# Altium schematic sheet main.SchDoc
size A3; Hw_rev: R1; Address3: Firenze; Address4: ITALY; Revision: 0; SheetNumber: 2; SheetTotal: 3
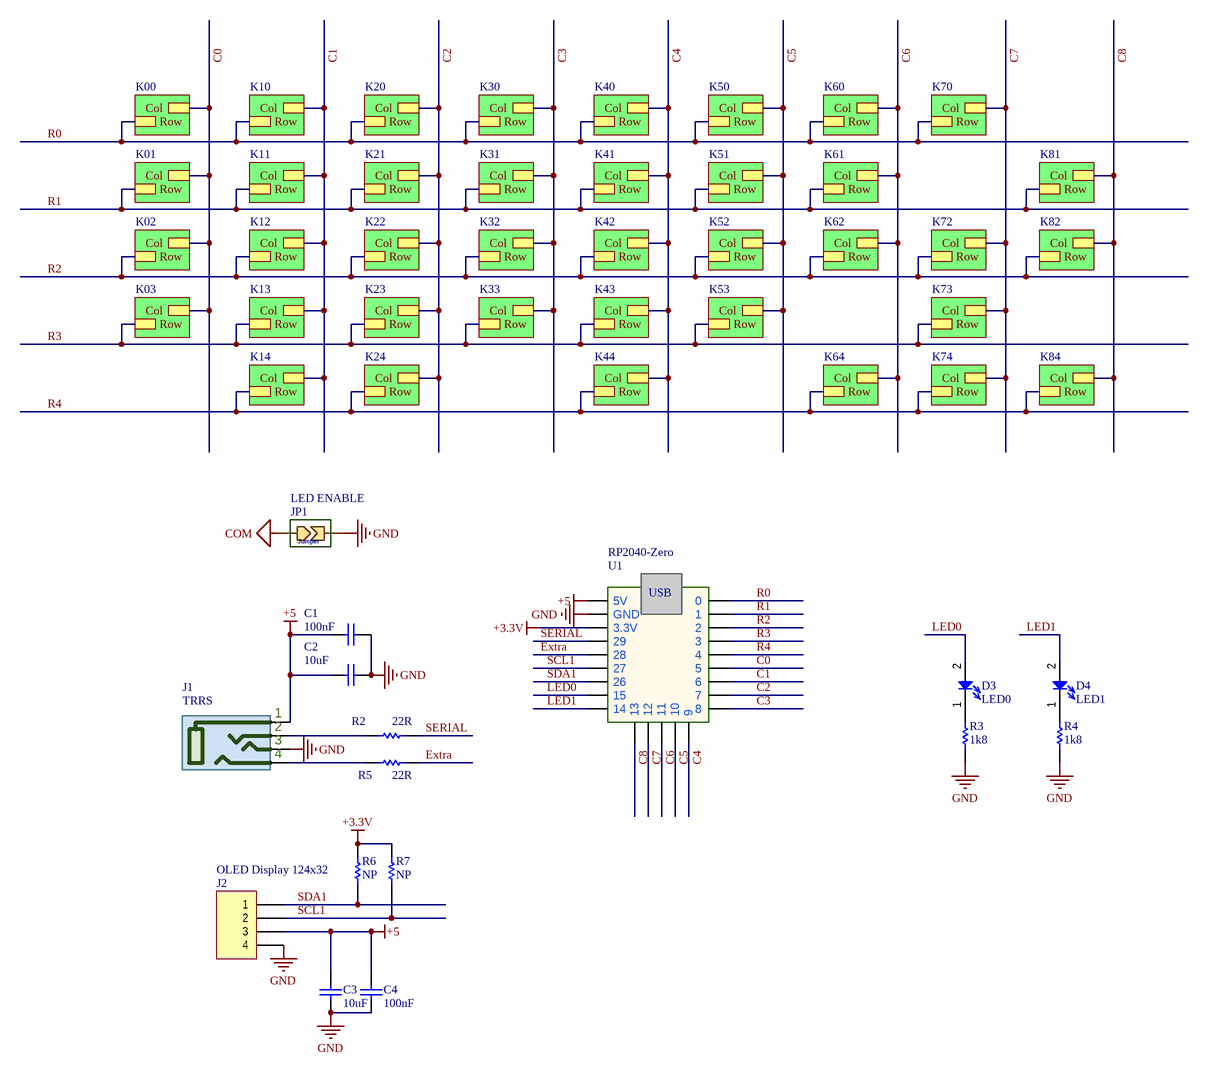
[diagram p0: main.SchDoc]

## Parts
C1  100nF  [0402_[1005]]
C2  10uF  [0603_[1608]]
C3  10uF  [0603_[1608]]
C4  100nF  [0402_[1005]]
D3  LED0  [0402_[1005]_K1-A2_LED]
D4  LED1  [0402_[1005]_K1-A2_LED]
J1  TRRS  [CON_PHONE_TRRS_3.5MM_THD]
J2  OLED Display 124x32  [HEADER_1X4_2.54MM_THD]
JP1  LED ENABLE  [0603_[1608]_JUMPER]
R2  22R  [0402_[1005]]
R3  1k8  [0402_[1005]]
R4  1k8  [0402_[1005]]
R5  22R  [0402_[1005]]
R6  NP  [0402_[1005]]
R7  NP  [0402_[1005]]
U1  RP2040-Zero  [RP2040-Zero]

## Sub-sheets
K00 = key-cell.SchDoc: Col, Row
K01 = key-cell.SchDoc: Col, Row
K02 = key-cell.SchDoc: Col, Row
K03 = key-cell.SchDoc: Col, Row
K10 = key-cell.SchDoc: Col, Row
K11 = key-cell.SchDoc: Col, Row
K12 = key-cell.SchDoc: Col, Row
K13 = key-cell.SchDoc: Col, Row
K14 = key-cell.SchDoc: Col, Row
K20 = key-cell.SchDoc: Col, Row
K21 = key-cell.SchDoc: Col, Row
K22 = key-cell.SchDoc: Col, Row
K23 = key-cell.SchDoc: Col, Row
K24 = key-cell.SchDoc: Col, Row
K30 = key-cell.SchDoc: Col, Row
K31 = key-cell.SchDoc: Col, Row
K32 = key-cell.SchDoc: Col, Row
K33 = key-cell.SchDoc: Col, Row
K40 = key-cell.SchDoc: Col, Row
K41 = key-cell.SchDoc: Col, Row
K42 = key-cell.SchDoc: Col, Row
K43 = key-cell.SchDoc: Col, Row
K44 = key-cell.SchDoc: Col, Row
K50 = key-cell.SchDoc: Col, Row
K51 = key-cell.SchDoc: Col, Row
K52 = key-cell.SchDoc: Col, Row
K53 = key-cell.SchDoc: Col, Row
K60 = key-cell.SchDoc: Col, Row
K61 = key-cell.SchDoc: Col, Row
K62 = key-cell.SchDoc: Col, Row
K64 = key-cell.SchDoc: Col, Row
K70 = key-cell.SchDoc: Col, Row
K72 = key-cell.SchDoc: Col, Row
K73 = key-cell.SchDoc: Col, Row
K74 = key-cell.SchDoc: Col, Row
K81 = key-cell.SchDoc: Col, Row
K82 = key-cell.SchDoc: Col, Row
K84 = key-cell.SchDoc: Col, Row

## Nets
+3.3V: R6.2 R7.2 U1.20(3.3V)
+5: C1.2 C2.2 C3.2 C4.2 J1.1 J2.3 U1.22(5V)
COM: JP1.1
GND: C1.1 C2.1 C3.1 C4.1 J1.3 J2.4 JP1.2 R3.1 R4.1 U1.21(GND)
C0: U1.5 ; sheet K00/Col, sheet K01/Col, sheet K02/Col, sheet K03/Col
C1: U1.6 ; sheet K10/Col, sheet K11/Col, sheet K12/Col, sheet K13/Col, sheet K14/Col
C2: U1.7 ; sheet K20/Col, sheet K21/Col, sheet K22/Col, sheet K23/Col, sheet K24/Col
C3: U1.8 ; sheet K30/Col, sheet K31/Col, sheet K32/Col, sheet K33/Col
C4: U1.9 ; sheet K40/Col, sheet K41/Col, sheet K42/Col, sheet K43/Col, sheet K44/Col
C5: U1.10 ; sheet K50/Col, sheet K51/Col, sheet K52/Col, sheet K53/Col
C6: U1.11 ; sheet K60/Col, sheet K64/Col, sheet K61/Col, sheet K62/Col
C7: U1.12 ; sheet K70/Col, sheet K74/Col, sheet K72/Col, sheet K73/Col
C8: U1.13 ; sheet K84/Col, sheet K82/Col, sheet K81/Col
Extra: R5.1 U1.18(28)
LED0: D3.2(A) U1.15
LED1: D4.2(A) U1.14
R0: U1.0 ; sheet K00/Row, sheet K10/Row, sheet K20/Row, sheet K30/Row, sheet K40/Row, sheet K50/Row, sheet K60/Row, sheet K70/Row
R1: U1.1 ; sheet K01/Row, sheet K11/Row, sheet K21/Row, sheet K31/Row, sheet K41/Row, sheet K51/Row, sheet K61/Row, sheet K81/Row
R2: U1.2 ; sheet K02/Row, sheet K12/Row, sheet K22/Row, sheet K32/Row, sheet K42/Row, sheet K52/Row, sheet K62/Row, sheet K72/Row, sheet K82/Row
R3: U1.3 ; sheet K03/Row, sheet K13/Row, sheet K23/Row, sheet K33/Row, sheet K43/Row, sheet K53/Row, sheet K73/Row
R4: U1.4 ; sheet K14/Row, sheet K24/Row, sheet K44/Row, sheet K64/Row, sheet K74/Row, sheet K84/Row
SCL1: J2.2 R7.1 U1.17(27)
SDA1: J2.1 R6.1 U1.16(26)
SERIAL: R2.1 U1.19(29)
NetD3_1: D3.1(K) R3.2
NetD4_1: D4.1(K) R4.2
NetJ1_2: J1.2 R2.2
NetJ1_4: J1.4 R5.2

## Notes on the sheet
- Title:
- Project:
- Desc:
- Variant:
- File:
- License:
- asterix24@gmail.com
- Ing. Daniele Basile
- Rev:
- Prj Rev:
- Status:
- Size:
- Date:
- Time:
- Sheet
- of
- A3
- (in symbol JumperSMD) Jumper
- (in symbol RP2040-Zero) USB

## Library data of the parts
C1-C4 = Cap: Capacitor; NOTE Manufacturer PN: *; NOTE Manufacturer: *; MountTechnology: *; CODE Develer: *; ComponentLink1Description: New link; ComponentLink1URL: *; NOTE Description: *; NOTE Description 2: *
  C1 C4: Value: 100nF
  C2 C3: Value: 10uF
D3 D4 = DiodeLedSmall: Diode Led; Publisher: Develer srl; Revision: 0.1; NOTE Manufacturer PN: *; NOTE Manufacturer: *; MountTechnology: SMT; CODE Develer: *; NOTE Description: *; NOTE Description 2: *
J1 = CON_PHONE_JACK_TSSR: headphone socket TRRS (Hong Cheng HC-PJ-320A); Publisher: Develer srl; Revision: 0.1; NOTE Manufacturer PN: *; NOTE Manufacturer: *; MountTechnology: SMT; CODE Develer: *; NOTE Description: *; NOTE Description 2: *
J2 = Header 4: Header, 4-Pin; LatestRevisionDate: 17-Jul-2002; LatestRevisionNote: Re-released for DXP Platform.; Publisher: Altium Limited
JP1 = JumperSMD: Jumper SMD; Publisher: Develer srl; Revision: 0.1; NOTE Manufacturer PN: *; NOTE Manufacturer: *; MountTechnology: SMT; CODE Develer: *; NOTE Description: *; NOTE Description 2: *
R2-R7 = Res: Resistor; Publisher: Develer srl; Revision: 0.1; NOTE Manufacturer PN: *; NOTE Manufacturer: *; MountTechnology: SMT; CODE Develer: *; NOTE Description: *; NOTE Description 2: *
U1 = RP2040-Zero: module, mini based on RP4020 (RP2350-Zero); Publisher: Develer srl; Revision: 0.1; NOTE Manufacturer PN: *; NOTE Manufacturer: *; MountTechnology: SMT; CODE Develer: *; NOTE Description: *; NOTE Description 2: *